# Altium schematic sheet GRBL3-10086.SchDoc
size A3
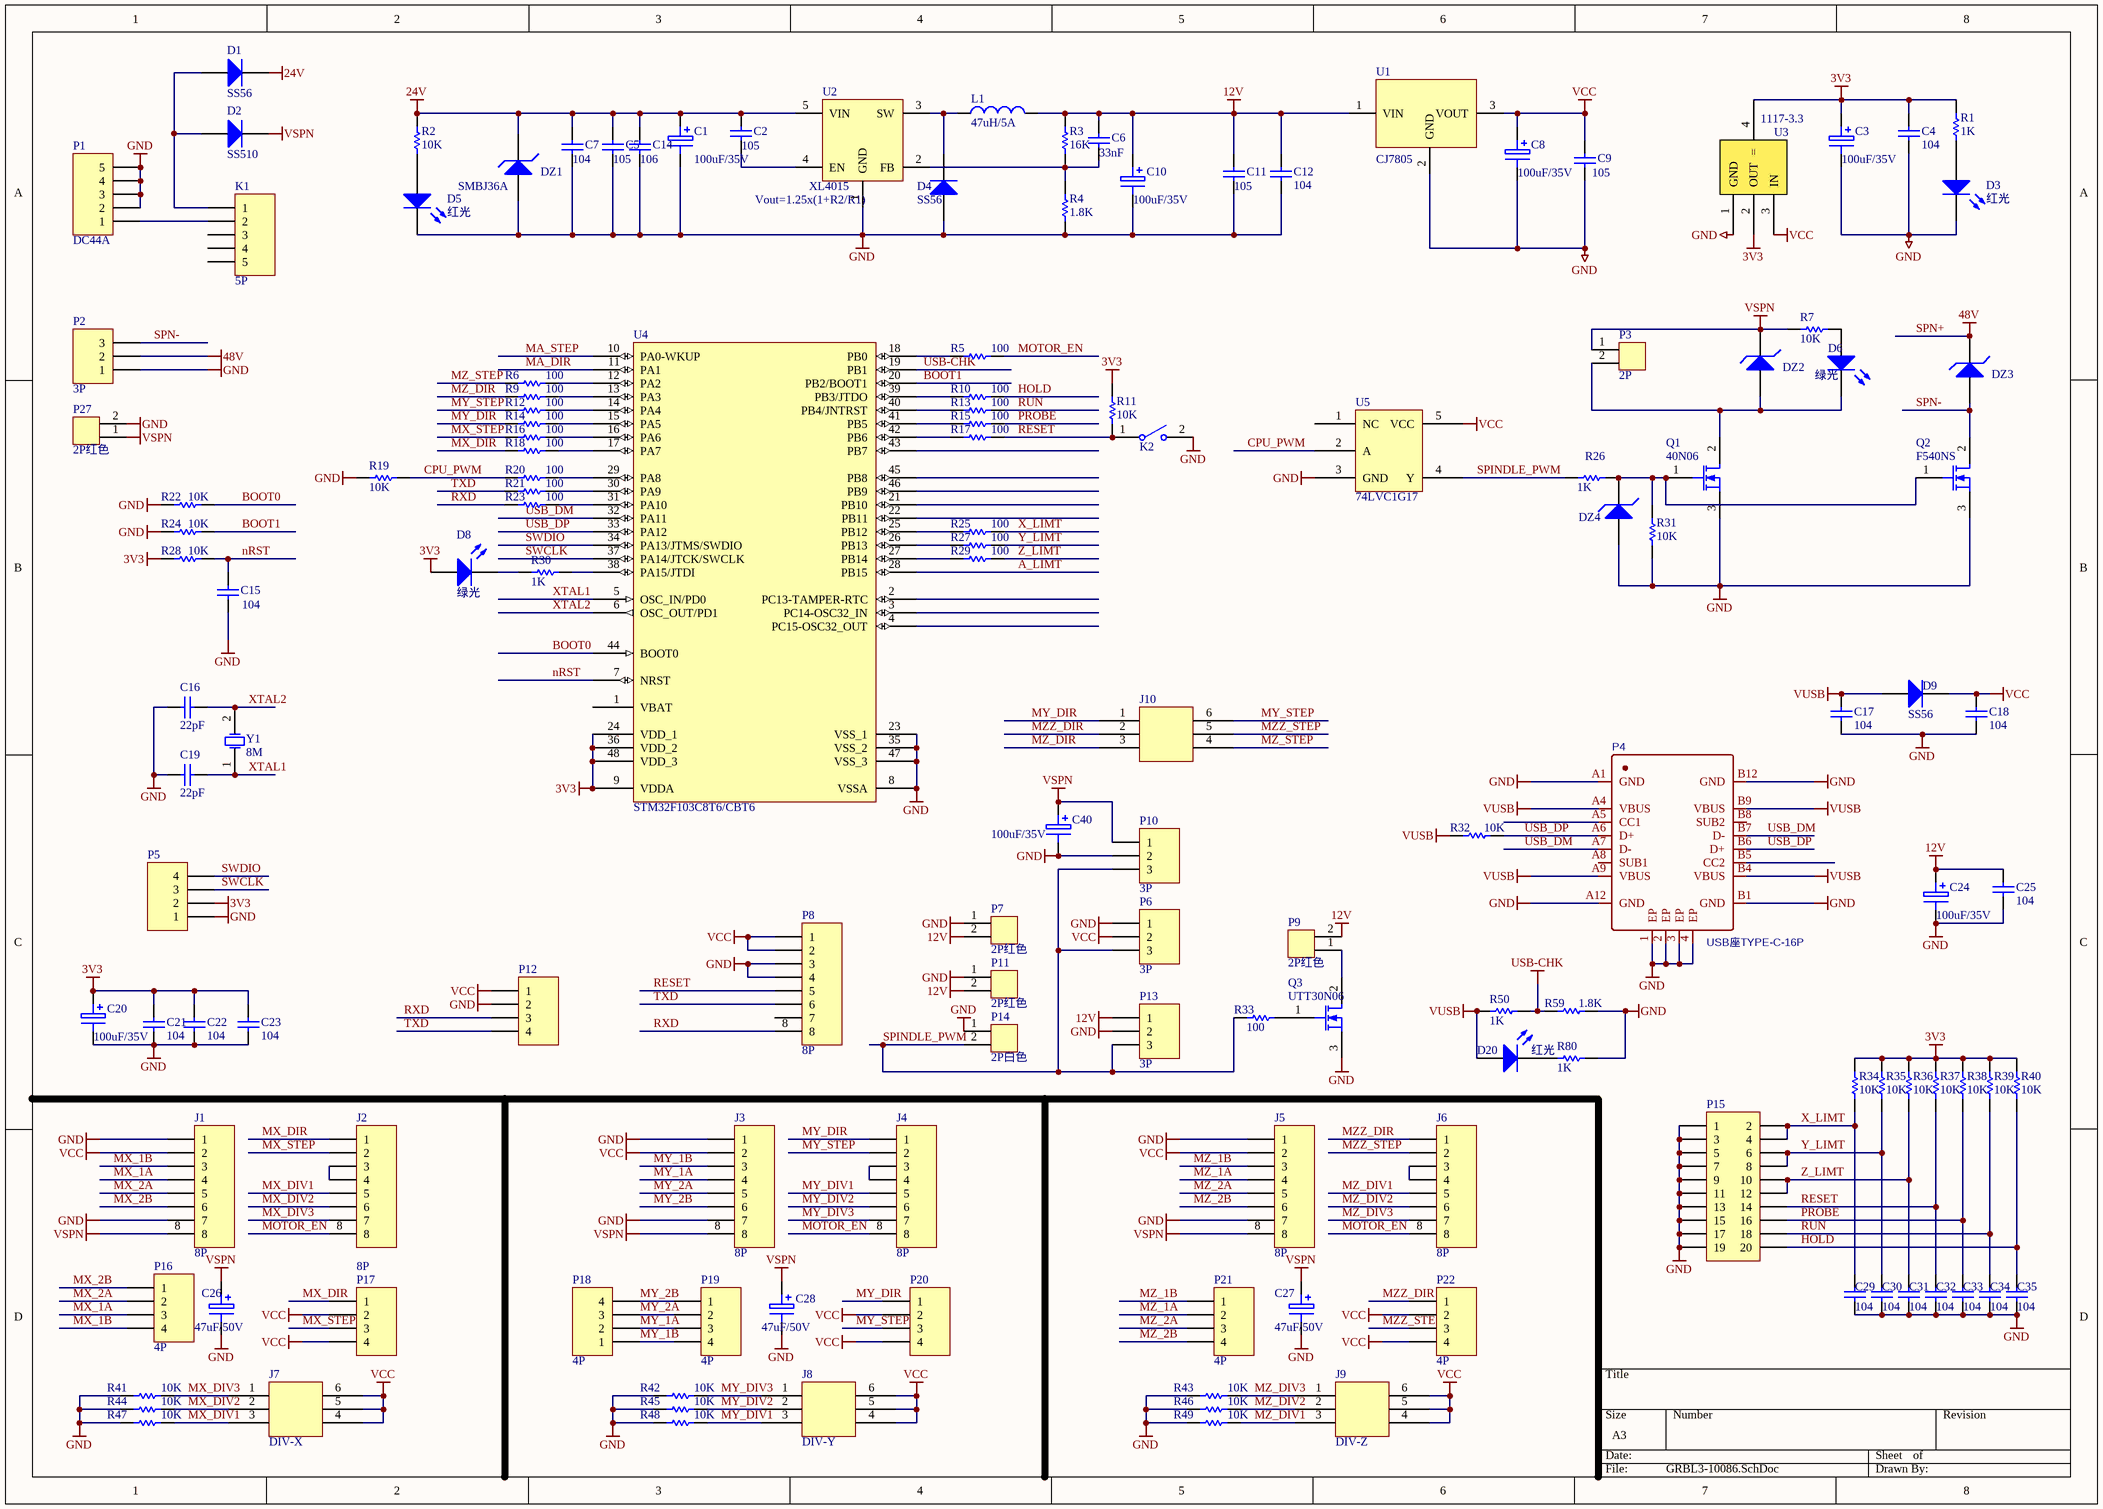
[diagram p0: GRBL3-10086.SchDoc]

## Parts
C1  100uF/35V  [电解电容贴片6x6]
C2  105  [0603C]
C3  100uF/35V  [电解电容贴片6x6]
C4  104  [0603C]
C5  105  [0603C]
C6  33nF  [0603C]
C7  104  [0603C]
C8  100uF/35V  [电解电容贴片6x6]
C9  105  [0603C]
C10  100uF/35V  [电解电容贴片6x6]
C11  105  [0603C]
C12  104  [0603C]
C14  106  [1206C]
C15  104  [0603C]
C16  22pF  [0603C]
C17  104  [0603C]
C18  104  [0603C]
C19  22pF  [0603C]
C20  100uF/35V  [电解电容贴片6x6]
C21  104  [0603C]
C22  104  [0603C]
C23  104  [0603C]
C24  100uF/35V  [电解电容贴片6x6]
C25  104  [0603C]
C26  47uF/50V  [电解电容贴片6x6]
C27  47uF/50V  [电解电容贴片6x6]
C28  47uF/50V  [电解电容贴片6x6]
C29  104  [0603C]
C30  104  [0603C]
C31  104  [0603C]
C32  104  [0603C]
C33  104  [0603C]
C34  104  [0603C]
C35  104  [0603C]
C40  100uF/35V  [电解电容贴片6x6]
D1  SS56  [SMA]
D2  SS510  [SMB]
D3  红光  [0603LED]
D4  SS56  [SMC]
D5  红光  [0603LED]
D6  绿光  [0603LED]
D8  绿光  [0603LED]
D9  SS56  [SMA]
D20  红光  [0603LED]
DZ1  SMBJ36A  [SMB]
DZ2  快恢复二极管RS5M  [SMC]  (value not drawn)
DZ3  快恢复二极管RS5M  [SMC]  (value not drawn)
DZ4  稳压二极管SMAZ10V  [SMA]  (value not drawn)
J1  8P  [HDR1X8]
J2  8P  [HDR1X8]
J3  8P  [HDR1X8]
J4  8P  [HDR1X8]
J5  8P  [HDR1X8]
J6  8P  [HDR1X8]
J7  DIV-X  [HDR2X3]
J8  DIV-Y  [HDR2X3]
J9  DIV-Z  [HDR2X3]
J10  DIV-Y  [HDR2X3]  (value not drawn)
K1  5P  [拨动开关SS12D11]
K2  开关  [按键6x6贴片5脚]  (value not drawn)
L1  47uH/5A  [电感贴片12x12]
P1  DC44A  [DC0044A]
P2  3P  [直插座3P-KF300]
P3  2P  [VH3.96-2P直插座]
P4  USB座TYPE-C-16P  [USB-TYPE-C-16P]
P5  (no value)  [SIP4]
P6  3P  [SIP3]
P7  2P红色  [HDR1X2_CON]
P8  8P  [IDC8]
P9  2P红色  [HDR1X2_CON]
P10  3P  [HDR1X3_CON]
P11  2P红色  [HDR1X2_CON]
P12  (no value)  [SIP4]
P13  3P  [HDR1X3_CON]
P14  2P白色  [HDR1X2_CON]
P15  Header 10X2H  [HDR2X10]  (value not drawn)
P16  4P  [HDR1X4_CON]
P17  (no value)  [SIP4]
P18  4P  [HDR1X4_CON]
P19  4P  [HDR1X4_CON]
P20  (no value)  [SIP4]
P21  4P  [HDR1X4_CON]
P22  4P  [SIP4]
P27  2P红色  [HDR1X2_CON]
Q1  40N06  [TO-252]
Q2  F540NS  [TO-263-2]
Q3  UTT30N06  [TO-252]
R1  1K  [0603R]
R2  10K  [0603R]
R3  16K  [0603R]
R4  1.8K  [0603R]
R5  100  [0603R]
R6  100  [0603R]
R7  10K  [0603R]
R9  100  [0603R]
R10  100  [0603R]
R11  10K  [0603R]
R12  100  [0603R]
R13  100  [0603R]
R14  100  [0603R]
R15  100  [0603R]
R16  100  [0603R]
R17  100  [0603R]
R18  100  [0603R]
R19  10K  [0603R]
R20  100  [0603R]
R21  100  [0603R]
R22  10k  [0603R]
R23  100  [0603R]
R24  10k  [0603R]
R25  100  [0603R]
R26  1K  [0603R]
R27  100  [0603R]
R28  10k  [0603R]
R29  100  [0603R]
R30  1K  [0603R]
R31  10K  [0603R]
R32  10K  [0603R]
R33  100  [0603R]
R34  10K  [0603R]
R35  10K  [0603R]
R36  10K  [0603R]
R37  10K  [0603R]
R38  10K  [0603R]
R39  10K  [0603R]
R40  10K  [0603R]
R41  10K  [0603R]
R42  10K  [0603R]
R43  10K  [0603R]
R44  10K  [0603R]
R45  10K  [0603R]
R46  10K  [0603R]
R47  10K  [0603R]
R48  10K  [0603R]
R49  10K  [0603R]
R50  1K  [0603R]
R59  1.8K  [0603R]
R80  1K  [0603R]
U1  CJ7805  [TO-263-2]
U2  XL4015  [TO-263]
U3  1117-3.3  [SOT-223]
U4  STM32F103C8T6/CBT6  [LQFP48]
U5  74LVC1G17  [SOT-23-5]
Y1  8M  [晶振贴片]

## Nets
3V3: C3.1 C4.2 C20.1 C21.2 C22.2 C23.2 D8.1 P5.2 R1.1 R11.2 R28.1 R34.2 R35.2 R36.2 R37.2 R38.2 R39.2 R40.2 U3.2(OUT) U3.4(=) U4.9(VDDA) U4.24(VDD_1) U4.36(VDD_2) U4.48(VDD_3)
12V: C6.2 C10.1 C11.2 C12.2 C24.1 C25.2 L1.2 P7.2 P9.2 P11.2 P13.1 R3.2 U1.1(VIN)
24V: C1.1 C2.2 C5.2 C7.2 C14.2 D1.2 DZ1.2 R2.1 U2.5(VIN)
GND: C1.2 C3.2 C4.1 C5.1 C7.1 C8.2 C9.1 C10.2 C11.1 C12.1 C14.1 C15.1 C16.2 C17.1 C18.1 C19.2 C20.2 C21.1 C22.1 C23.1 C24.2 C25.1 C26.2 C27.2 C28.2 C29.1 C30.1 C31.1 C32.1 C33.1 C34.1 C35.1 C40.2 D3.2 D4.1 D5.2 DZ1.1 DZ4.1 J1.1 J1.7 J3.1 J3.7 J5.1 J5.7 K2.2(NO) P1.2 P1.3 P1.4 P1.5 P2.1 P4.1(EP) P4.2(EP) P4.3(EP) P4.4(EP) P4.A1(GND) P4.A12(GND) P4.B1(GND) P4.B12(GND) P5.1 P6.1 P7.1 P8.3 P8.4 P10.2 P11.1 P12.2 P13.2 P14.1 P15.1 P15.3 P15.5 P15.7 P15.9 P15.11 P15.13 P15.15 P15.17 P15.19 P27.2 Q1.3(S) Q2.3(S) Q3.3(S) R4.1 R19.2 R22.1 R24.1 R31.2 R41.2 R42.2 R43.2 R44.2 R45.2 R46.2 R47.2 R48.2 R49.2 R59.2 R80.1 U1.2(GND) U2.1(GND) U3.1(GND) U4.8(VSSA) U4.23(VSS_1) U4.35(VSS_2) U4.47(VSS_3) U5.3(GND)
SPN+: DZ3.2 P2.2  [also labelled 48V]
USB-CHK: R50.2 R59.1 U4.19(PB1)
VCC: C8.1 C9.2 C18.2 D9.2 J1.2 J3.2 J5.2 J7.4 J7.5 J7.6 J8.4 J8.5 J8.6 J9.4 J9.5 J9.6 P6.2 P8.1 P8.2 P12.1 P17.2 P17.4 P20.2 P20.4 P22.2 P22.4 U1.3(VOUT) U3.3(IN) U5.5(VCC)
VSPN: C26.1 C27.1 C28.1 C40.1 D2.2 DZ2.2 J1.8 J3.8 J5.8 P3.1 P10.1 P27.1 R7.1
VUSB: C17.2 D9.1 D20.1 P4.A4(VBUS) P4.A9(VBUS) P4.B4(VBUS) P4.B9(VBUS) R32.1 R50.1
A_LIMT: U4.28(PB15)
BOOT0: R22.2 U4.44(BOOT0)
BOOT1: R24.2 U4.20(PB2/BOOT1)
CPU_PWM: R19.1 R20.1 U5.2(A)
HOLD: C35.2 P15.20 R10.2 R40.1
MA_DIR: U4.11(PA1)
MA_STEP: U4.10(PA0-WKUP)
MOTOR_EN: J2.8 J4.8 J6.8 R5.2
MX_1A: J1.4 P16.3
MX_1B: J1.3 P16.4
MX_2A: J1.5 P16.2
MX_2B: J1.6 P16.1
MX_DIR: J2.1 P17.1 R18.1
MX_DIV1: J2.5 J7.3 R47.1
MX_DIV2: J2.6 J7.2 R44.1
MX_DIV3: J2.7 J7.1 R41.1
MX_STEP: J2.2 P17.3 R16.1
MY_1A: J3.4 P18.2 P19.3
MY_1B: J3.3 P18.1 P19.4
MY_2A: J3.5 P18.3 P19.2
MY_2B: J3.6 P18.4 P19.1
MY_DIR: J4.1 J10.1 P20.1 R14.1
MY_DIV1: J4.5 J8.3 R48.1
MY_DIV2: J4.6 J8.2 R45.1
MY_DIV3: J4.7 J8.1 R42.1
MY_STEP: J4.2 J10.6 P20.3 R12.1
MZ_1A: J5.4 P21.2
MZ_1B: J5.3 P21.1
MZ_2A: J5.5 P21.3
MZ_2B: J5.6 P21.4
MZ_DIR: J10.3 R9.1
MZ_DIV1: J6.5 J9.3 R49.1
MZ_DIV2: J6.6 J9.2 R46.1
MZ_DIV3: J6.7 J9.1 R43.1
MZ_STEP: J10.4 R6.1
MZZ_DIR: J6.1 J10.2 P22.1
MZZ_STEP: J6.2 J10.5 P22.3
nRST: C15.2 R28.2 U4.7(NRST)
PROBE: C33.2 P15.16 R15.2 R38.1
RESET: C32.2 K2.1(COMMON) P8.5 P15.14 R11.1 R17.2 R37.1
RUN: C34.2 P15.18 R13.2 R39.1
RXD: P8.8 P12.3 R23.1
SPINDLE_PWM: P6.3 P10.3 P13.3 P14.2 R26.1 R33.1 U5.4(Y)
SPN-: DZ3.1 P2.3 Q2.2(D)
SWCLK: P5.3 U4.37(PA14/JTCK/SWCLK)
SWDIO: P5.4 U4.34(PA13/JTMS/SWDIO)
TXD: P8.6 P12.4 R21.1
USB_DM: P4.A7(D-) P4.B7(D-) U4.32(PA11)
USB_DP: P4.A6(D+) P4.B6(D+) R32.2 U4.33(PA12)
X_LIMT: C29.2 P15.2 P15.4 R25.2 R34.1
XTAL1: C19.1 U4.5(OSC_IN/PD0) Y1.1(OSC1)
XTAL2: C16.1 U4.6(OSC_OUT/PD1) Y1.2(OSC2)
Y_LIMT: C30.2 P15.6 P15.8 R27.2 R35.1
Z_LIMT: C31.2 P15.10 P15.12 R29.2 R36.1
NetC2_1: C2.1 U2.4(EN)
NetC6_1: C6.1 R3.1 R4.2 U2.2(FB)
NetD1_1: D1.1 D2.1 K1.1
NetD3_1: D3.1 R1.2
NetD4_2: D4.2 L1.1 U2.3(SW)
NetD5_1: D5.1 R2.2
NetD6_1: D6.1 R7.2
NetD6_2: D6.2 DZ2.1 P3.2 Q1.2(D)
NetD8_2: D8.2 R30.2
NetD20_2: D20.2 R80.2
NetDZ4_2: DZ4.2 Q1.1(G) Q2.1(G) R26.2 R31.1
NetJ2_3: J2.3 J2.4
NetJ4_3: J4.3 J4.4
NetJ6_3: J6.3 J6.4
NetK1_2: K1.2 P1.1
NetP9_1: P9.1 Q3.2(D)
NetQ3_1: Q3.1(G) R33.2
NetR5_1: R5.1 U4.18(PB0)
NetR6_2: R6.2 U4.12(PA2)
NetR9_2: R9.2 U4.13(PA3)
NetR10_1: R10.1 U4.39(PB3/JTDO)
NetR12_2: R12.2 U4.14(PA4)
NetR13_1: R13.1 U4.40(PB4/JNTRST)
NetR14_2: R14.2 U4.15(PA5)
NetR15_1: R15.1 U4.41(PB5)
NetR16_2: R16.2 U4.16(PA6)
NetR17_1: R17.1 U4.42(PB6)
NetR18_2: R18.2 U4.17(PA7)
NetR20_2: R20.2 U4.29(PA8)
NetR21_2: R21.2 U4.30(PA9)
NetR23_2: R23.2 U4.31(PA10)
NetR25_1: R25.1 U4.25(PB12)
NetR27_1: R27.1 U4.26(PB13)
NetR29_1: R29.1 U4.27(PB14)
NetR30_1: R30.1 U4.38(PA15/JTDI)

Not connected (* = marked no-connect by the designer): K1 3 4 5; P4 A5(CC1) A8(SUB1) B5(CC2) B8(SUB2); P8 7; U4 1(VBAT) 2(PC13-TAMPER-RTC) 3(PC14-OSC32_IN) 4(PC15-OSC32_OUT) 21(PB10) 22(PB11) 43(PB7) 45(PB8) 46(PB9); U5 1(NC)

## Notes on the sheet
- (near U2) Vout=1.25x(1+R2/R1)

## Library data of the parts
C1 C3 C8 C10 C20 C24 C26-C28 C40 = ELECTRO1
C2 C5-C7 C11 C14 C21-C23 = CAP
  C21-C23: value: 104
C4 C9 C12 C15 C17 C18 C25 = Cap Semi: Capacitor (Semiconductor SIM Model); Published: 8-Jun-2000; LatestRevisionDate: 17-Jul-2002; LatestRevisionNote: Re-released for DXP Platform.; PackageReference: C1206; Publisher: Altium Limited
  C4 C12 C17 C18 C25: Value: 104
C16 C19 = Cap Semi: Capacitor (Semiconductor SIM Model); Value: 100pF; Published: 8-Jun-2000; LatestRevisionDate: 17-Jul-2002; LatestRevisionNote: Re-released for DXP Platform.; PackageReference: C1206; Publisher: Altium Limited
C29-C35 = Cap Semi: Capacitor (Semiconductor SIM Model); Value: 18pF; Published: 8-Jun-2000; LatestRevisionDate: 17-Jul-2002; LatestRevisionNote: Re-released for DXP Platform.; PackageReference: C1206; Publisher: Altium Limited
D1 D2 D4 D9 = 1N4148
D3 D5 D6 D8 D20 = LED
DZ1-DZ4 = 稳压二极管
J7-J10 = DIP6
L1 = Inductor: Code_IEC: 1005; Published: 8-Jun-2000; LatestRevisionDate: 29-May-2009; LatestRevisionNote: IPC-7351 Footprint Added.; PackageReference: 0402-A; Publisher: Altium Limited; PackageDescription: Chip Inductor; Code_JEITA: 0402
P1 = Header 5: Header, 5-Pin; LatestRevisionDate: 17-Jul-2002; LatestRevisionNote: Re-released for DXP Platform.; Publisher: Altium Limited
P4 = USB座TYPE-C-16P: BOM_Manufacturer: Shenzhen Kinghelm Elec; BOM_Manufacturer Part: KH-TYPE-C-16P-T; Contributor: LCSC; BOM_Supplier: LCSC; BOM_Supplier Part: C709358; spicePre: U; spiceSymbolName: KH-TYPE-C-16P-T
P5 P12 P17 P20 = 4P
P7 P9 P11 P14 P27 = 2P
P15 = Header 10X2H: Header, 10-Pin, Dual row, Right Angle; LatestRevisionDate: 17-Jul-2002; LatestRevisionNote: Re-released for DXP Platform.; Publisher: Altium Limited
Q1-Q3 = MOSFET-N: N-Channel MOSFET; Published: 8-Jun-2000; LatestRevisionDate: 17-Jul-2002; LatestRevisionNote: Re-released for DXP Platform.; PackageVersion: 1995/1996; PackageReference: E3; Publisher: Altium Limited
R1-R7 R9-R50 R59 R80 = RES: Resistor; Published: 8-Jun-2000; LatestRevisionDate: 17-Jul-2002; LatestRevisionNote: Re-released for DXP Platform.; PackageReference: AXIAL-0.3; Publisher: Altium Limited
  R22 R24 R28: Value: 10K
U1 = 7805
U2 = XL4005
U3 = LM1117
U4 = STM32F103C6T6: STM32 ARM-based 32-bit MCU with 32 Kbytes Flash, 48-pin LQFP, Industrial Temperature; Published: *; DatasheetVersion: *; PackageVersion: *; PackageReference: *; Publisher: *; PackageDescription: *; ComponentLink1Description: *; ComponentLink1URL: *; ComponentLink2Description: *; ComponentLink2URL: *
Y1 = XTAL: Crystal Oscillator; Published: 8-Jun-2000; LatestRevisionDate: 17-Jul-2002; LatestRevisionNote: Re-released for DXP Platform.; PackageReference: R38; Publisher: Altium Limited